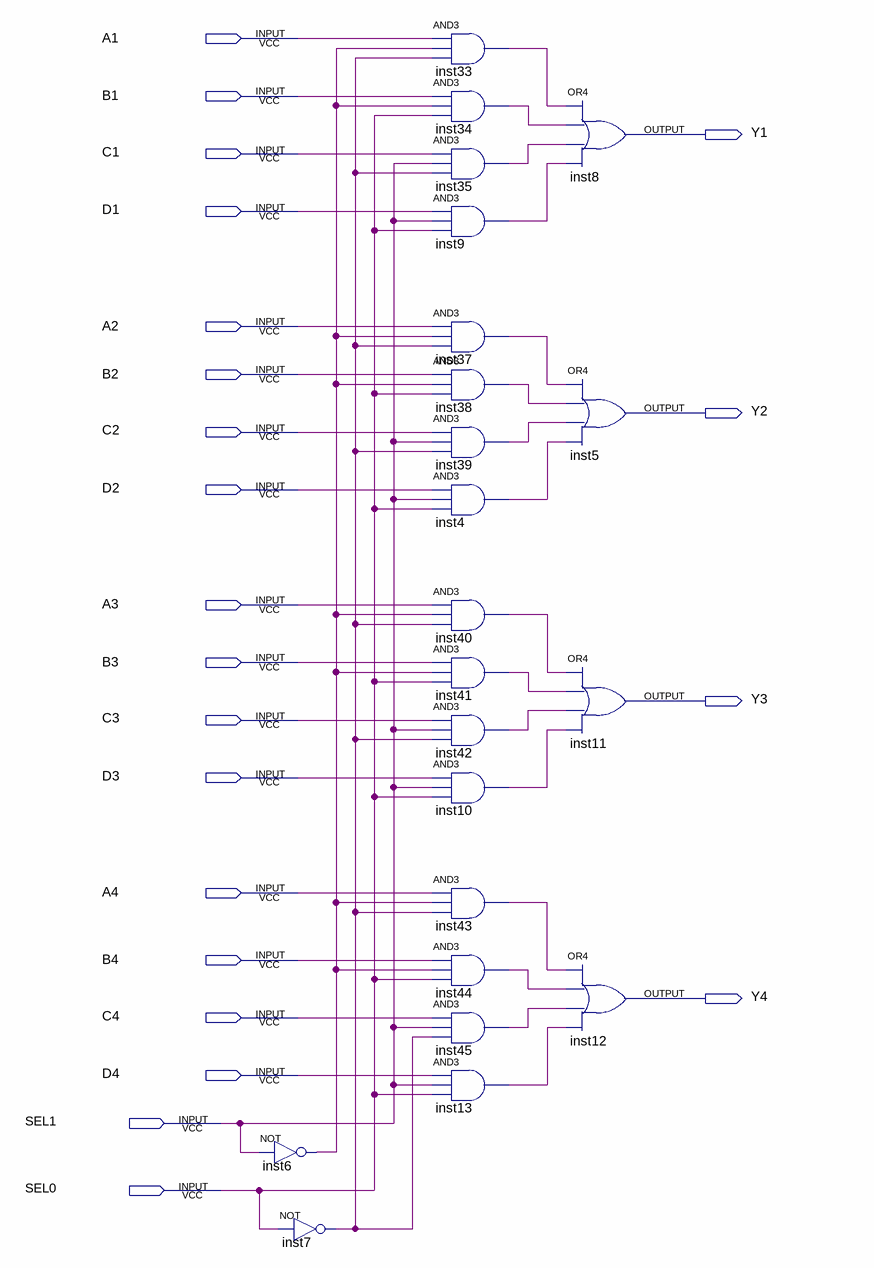
[diagram p0: schematic sheet]
// Quartus schematic MUX.bdf as structural Verilog: 22 symbols, 22 pins
module MUX (
  input  A1,
  input  B1,
  input  C1,
  input  D1,
  input  A2,
  input  B2,
  input  C2,
  input  D2,
  input  A3,
  input  B3,
  input  C3,
  input  D3,
  input  A4,
  input  B4,
  input  C4,
  input  D4,
  input  SEL1,
  input  SEL0,
  output Y1,
  output Y2,
  output Y3,
  output Y4
);

  wire inst4_out, inst6_out, inst7_out, inst9_out, inst10_out, inst13_out, inst33_out, inst34_out,
       inst35_out, inst37_out, inst38_out, inst39_out, inst40_out, inst41_out, inst42_out, inst43_out,
       inst44_out, inst45_out;

  not inst6 (inst6_out, SEL1);
  not inst7 (inst7_out, SEL0);
  and inst33 (inst33_out, A1, inst6_out, inst7_out);
  and inst34 (inst34_out, B1, inst6_out, SEL0);
  and inst35 (inst35_out, C1, SEL1, inst7_out);
  and inst9 (inst9_out, D1, SEL1, SEL0);
  and inst37 (inst37_out, A2, inst6_out, inst7_out);
  and inst38 (inst38_out, B2, inst6_out, SEL0);
  and inst39 (inst39_out, C2, SEL1, inst7_out);
  and inst4 (inst4_out, D2, SEL1, SEL0);
  and inst40 (inst40_out, A3, inst6_out, inst7_out);
  and inst41 (inst41_out, B3, inst6_out, SEL0);
  and inst42 (inst42_out, C3, SEL1, inst7_out);
  and inst10 (inst10_out, D3, SEL1, SEL0);
  and inst43 (inst43_out, A4, inst6_out, inst7_out);
  and inst44 (inst44_out, B4, inst6_out, SEL0);
  and inst45 (inst45_out, C4, SEL1, inst7_out);
  and inst13 (inst13_out, D4, SEL1, SEL0);
  or inst8 (Y1, inst33_out, inst34_out, inst35_out, inst9_out);
  or inst5 (Y2, inst37_out, inst38_out, inst39_out, inst4_out);
  or inst11 (Y3, inst40_out, inst41_out, inst42_out, inst10_out);
  or inst12 (Y4, inst43_out, inst44_out, inst45_out, inst13_out);
endmodule
